# Altium project PicoBerry_V1.0.PrjPcb
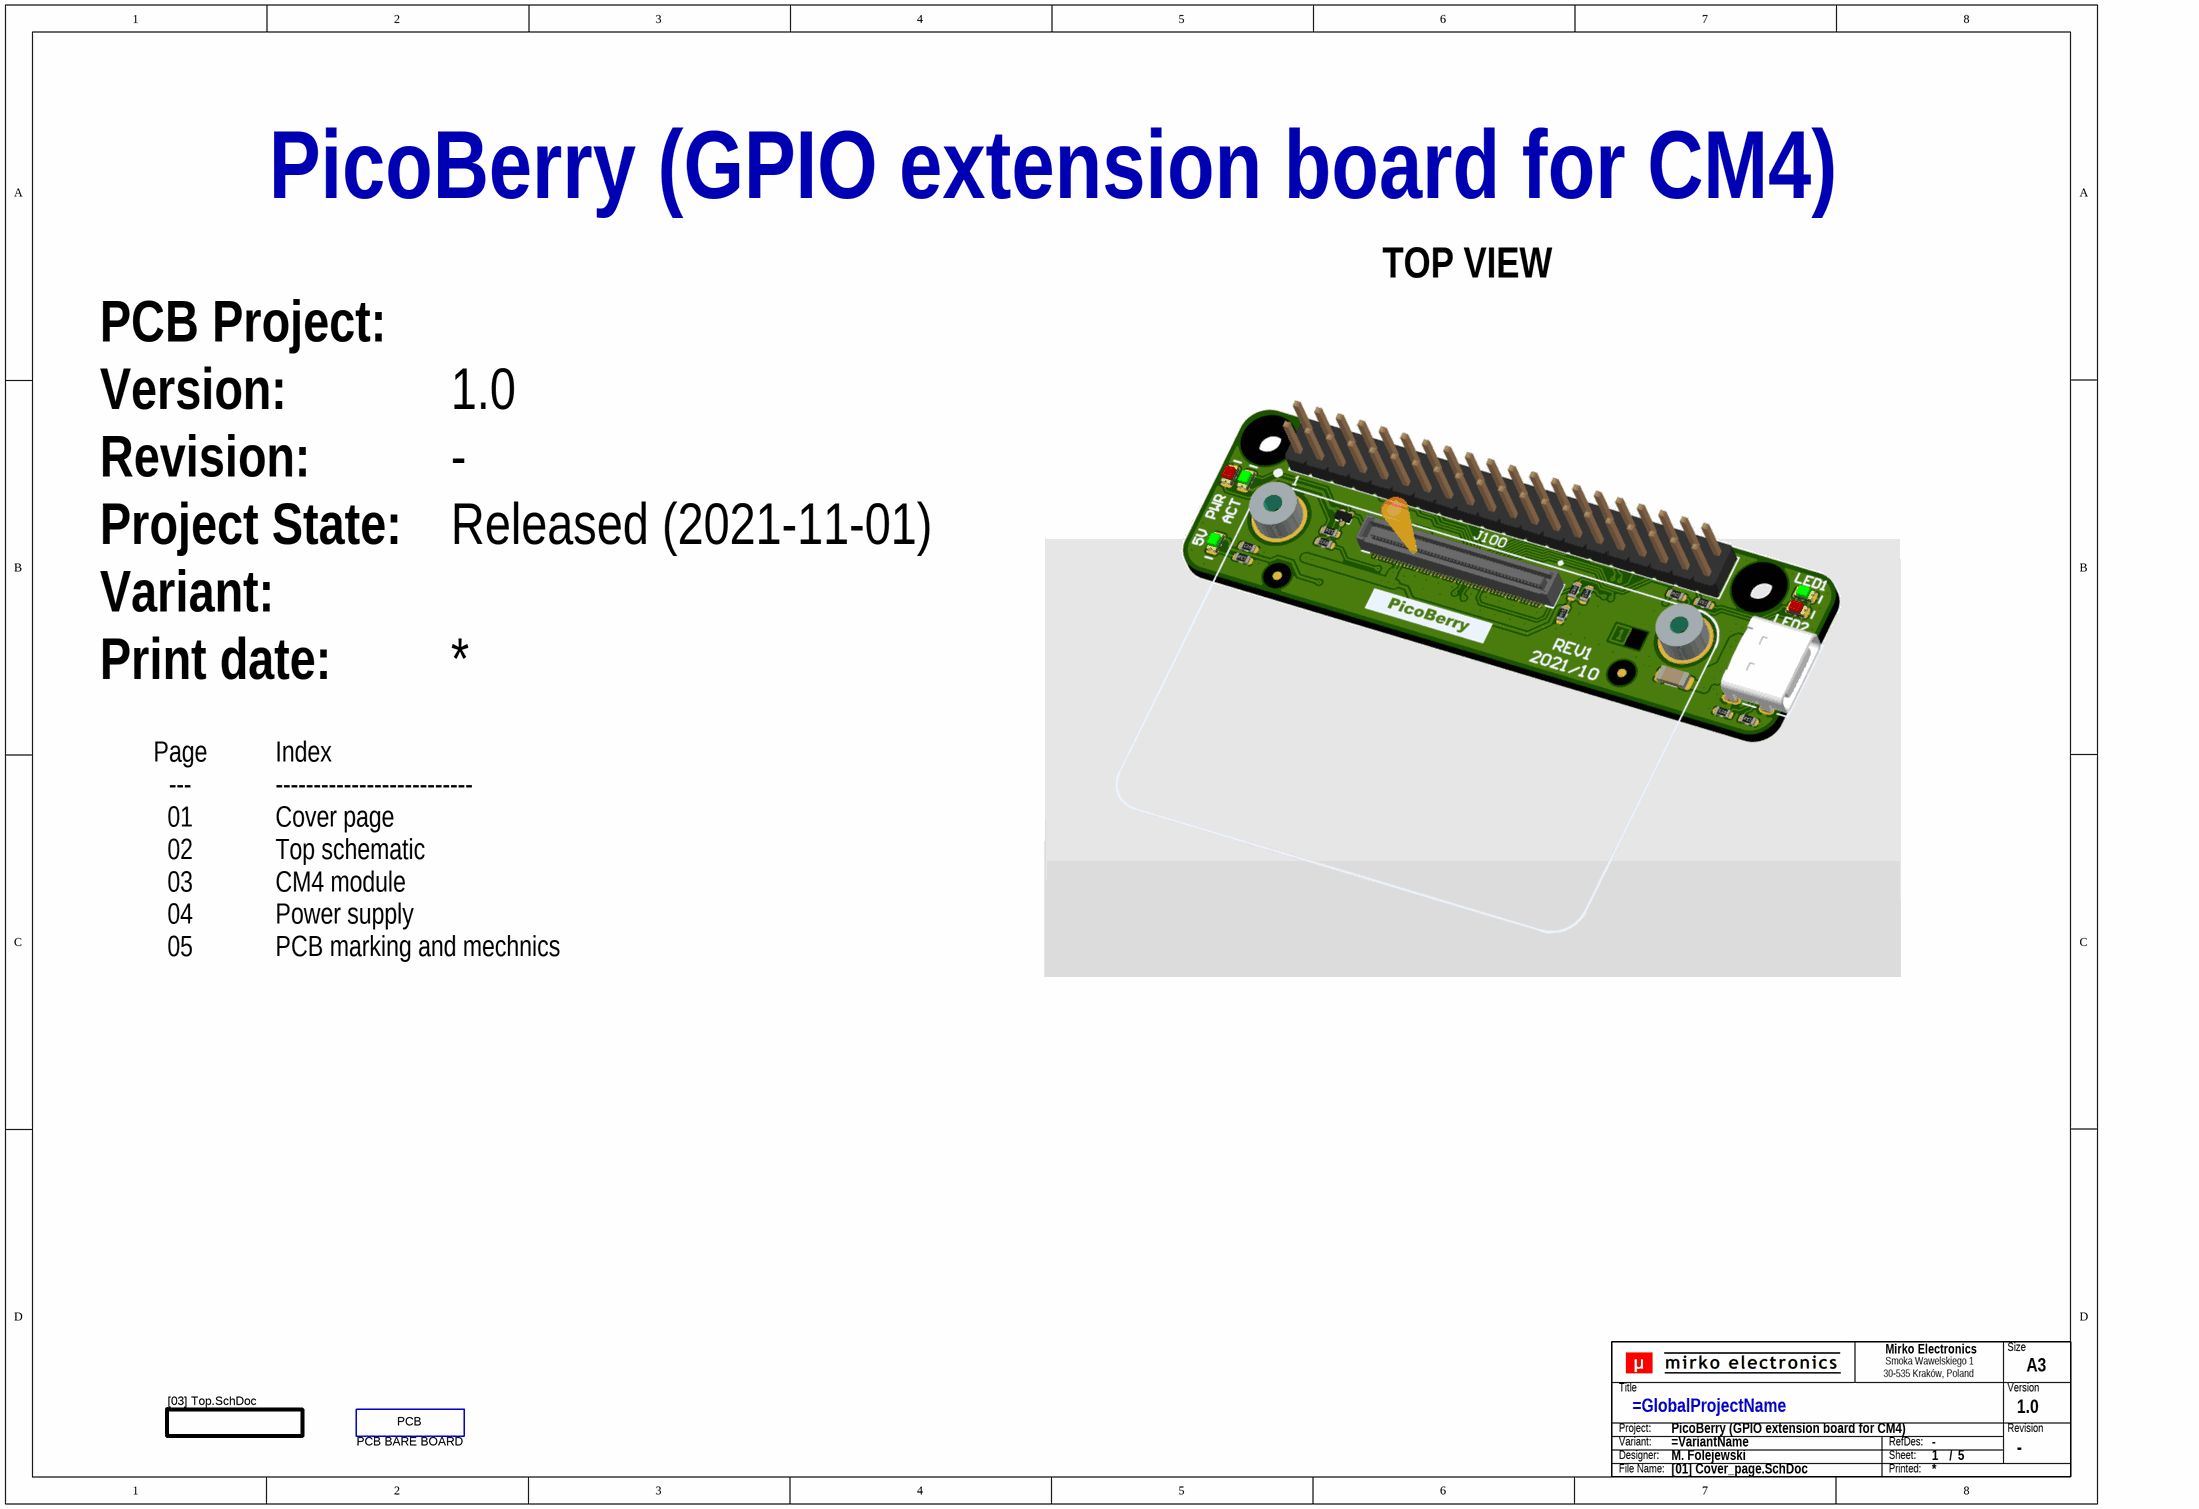
[diagram p0: [01] Cover_page.SchDoc]
GlobalProjectName: PicoBerry; OutputFileNamePrefix: PicoBerry_V1.0; PCBProjectName: PicoBerry (GPIO extension board for CM4); SchPcbReleaseState: Released (2021-11-01); SchPcbRevision: -; SchPcbVersion: 1.0
5 sheets, 41 parts. Net scope: global (net labels, ports and power ports of the same name join across sheets).
Board file: PicoBerry_V1.0.PcbDoc
Sheets:
  [01] Cover_page.SchDoc
  [02] TOP.SchDoc
  [03] CM4_PART1.SchDoc
  [04] PWR.SchDoc
  [05] PCB_Mech.SchDoc

## Sheet [01] Cover_page.SchDoc: =GlobalProjectName
size A3; Engineer: M. Folejewski; DocumentNumber: 1; SheetNumber: 1; SheetTotal: 5; Designators: -; PageSize: A3

### Parts
(Parts that share a designator on the sheet are numbered #1, #2 ... from top to bottom, then left to right.)
PCB1  PCB BARE BOARD  (mechanical)
TB?#1  Title block  (value not drawn)  (graphical)

### Sub-sheets
D9 = [03] Top.SchDoc (file not in this document): no entries

### Notes on the sheet
- TOP VIEW
- PCB Project:
- Version:
- Revision:
- Project State:
- Variant:
- Print date:
- Page
  ---
  01
  02
  03
  04
  05
- Index
  --------------------------
  Cover page
  Top schematic
  CM4 module
  Power supply
  PCB marking and mechnics
- (in symbol PCB_BARE_BOARD) PCB
- (in symbol SCH_TITLE_BLOCK_V1) Mirko Electronics; Size; Smoka Wawelskiego 1; 30-535 Kraków, Poland; Title; Version; Project:; Revision; Variant:; RefDes:; Designer:; Sheet:; /; File Name:; Printed:

### Library data of the parts
PCB1 = PCB_BARE_BOARD: Component Subtype: PCB Board; Component Type: PCB board; Manufacturer: -; MPN: N/A; Value: PCB BARE BOARD; Mounting Type: -; Supplier: ?
TB?#1 = SCH_TITLE_BLOCK_V1: Component Type: Title block; Manufacturer: -; Mounting Type: Non component; MPN: -; Operating Temperature: -; Package: -; Specification: Title block; Value: Title block; Replacement: -; System: ?

## Sheet [02] TOP.SchDoc: Top schematic
size A4; Engineer: M. Folejewski; DocumentNumber: 2; SheetNumber: 2; SheetTotal: 5; PageSize: A4; Designators: 1-99
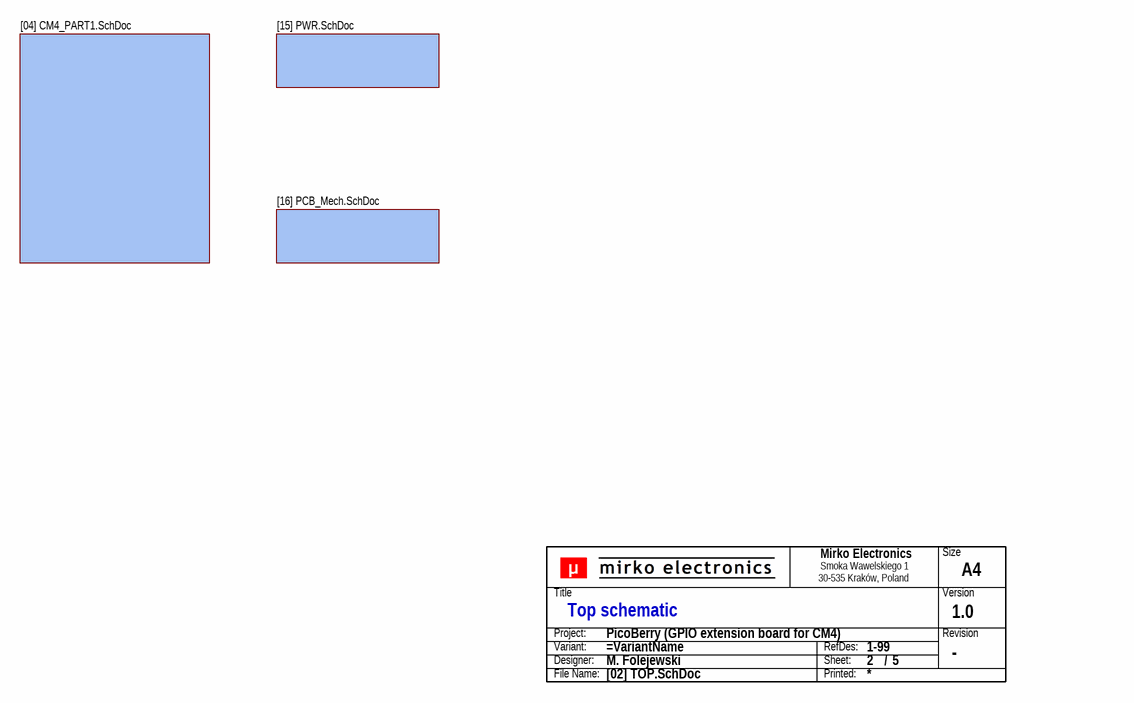
[diagram p1: [02] TOP.SchDoc]

### Parts
(Parts that share a designator on the sheet are numbered #1, #2 ... from top to bottom, then left to right.)
TB?#2  Title block  (value not drawn)  (graphical)

### Sub-sheets
BLK1 = [04] CM4_PART1.SchDoc (file not in this document): no entries
BLK4 = [16] PCB_Mech.SchDoc (file not in this document): no entries
BLK4 = [15] PWR.SchDoc (file not in this document): no entries

### Notes on the sheet
- (in symbol SCH_TITLE_BLOCK_V1) Mirko Electronics; Size; Smoka Wawelskiego 1; 30-535 Kraków, Poland; Title; Version; Project:; Revision; Variant:; RefDes:; Designer:; Sheet:; /; File Name:; Printed:

### Library data of the parts
TB?#2 = SCH_TITLE_BLOCK_V1: Component Type: Title block; Manufacturer: -; Mounting Type: Non component; MPN: -; Operating Temperature: -; Package: -; Specification: Title block; Value: Title block; Replacement: -; System: ?

## Sheet [03] CM4_PART1.SchDoc: Compute Module 4 (CM4)
size A3; Engineer: M. Folejewski; DocumentNumber: 3; SheetNumber: 3; SheetTotal: 5; PageSize: A3; Designators: 100-199
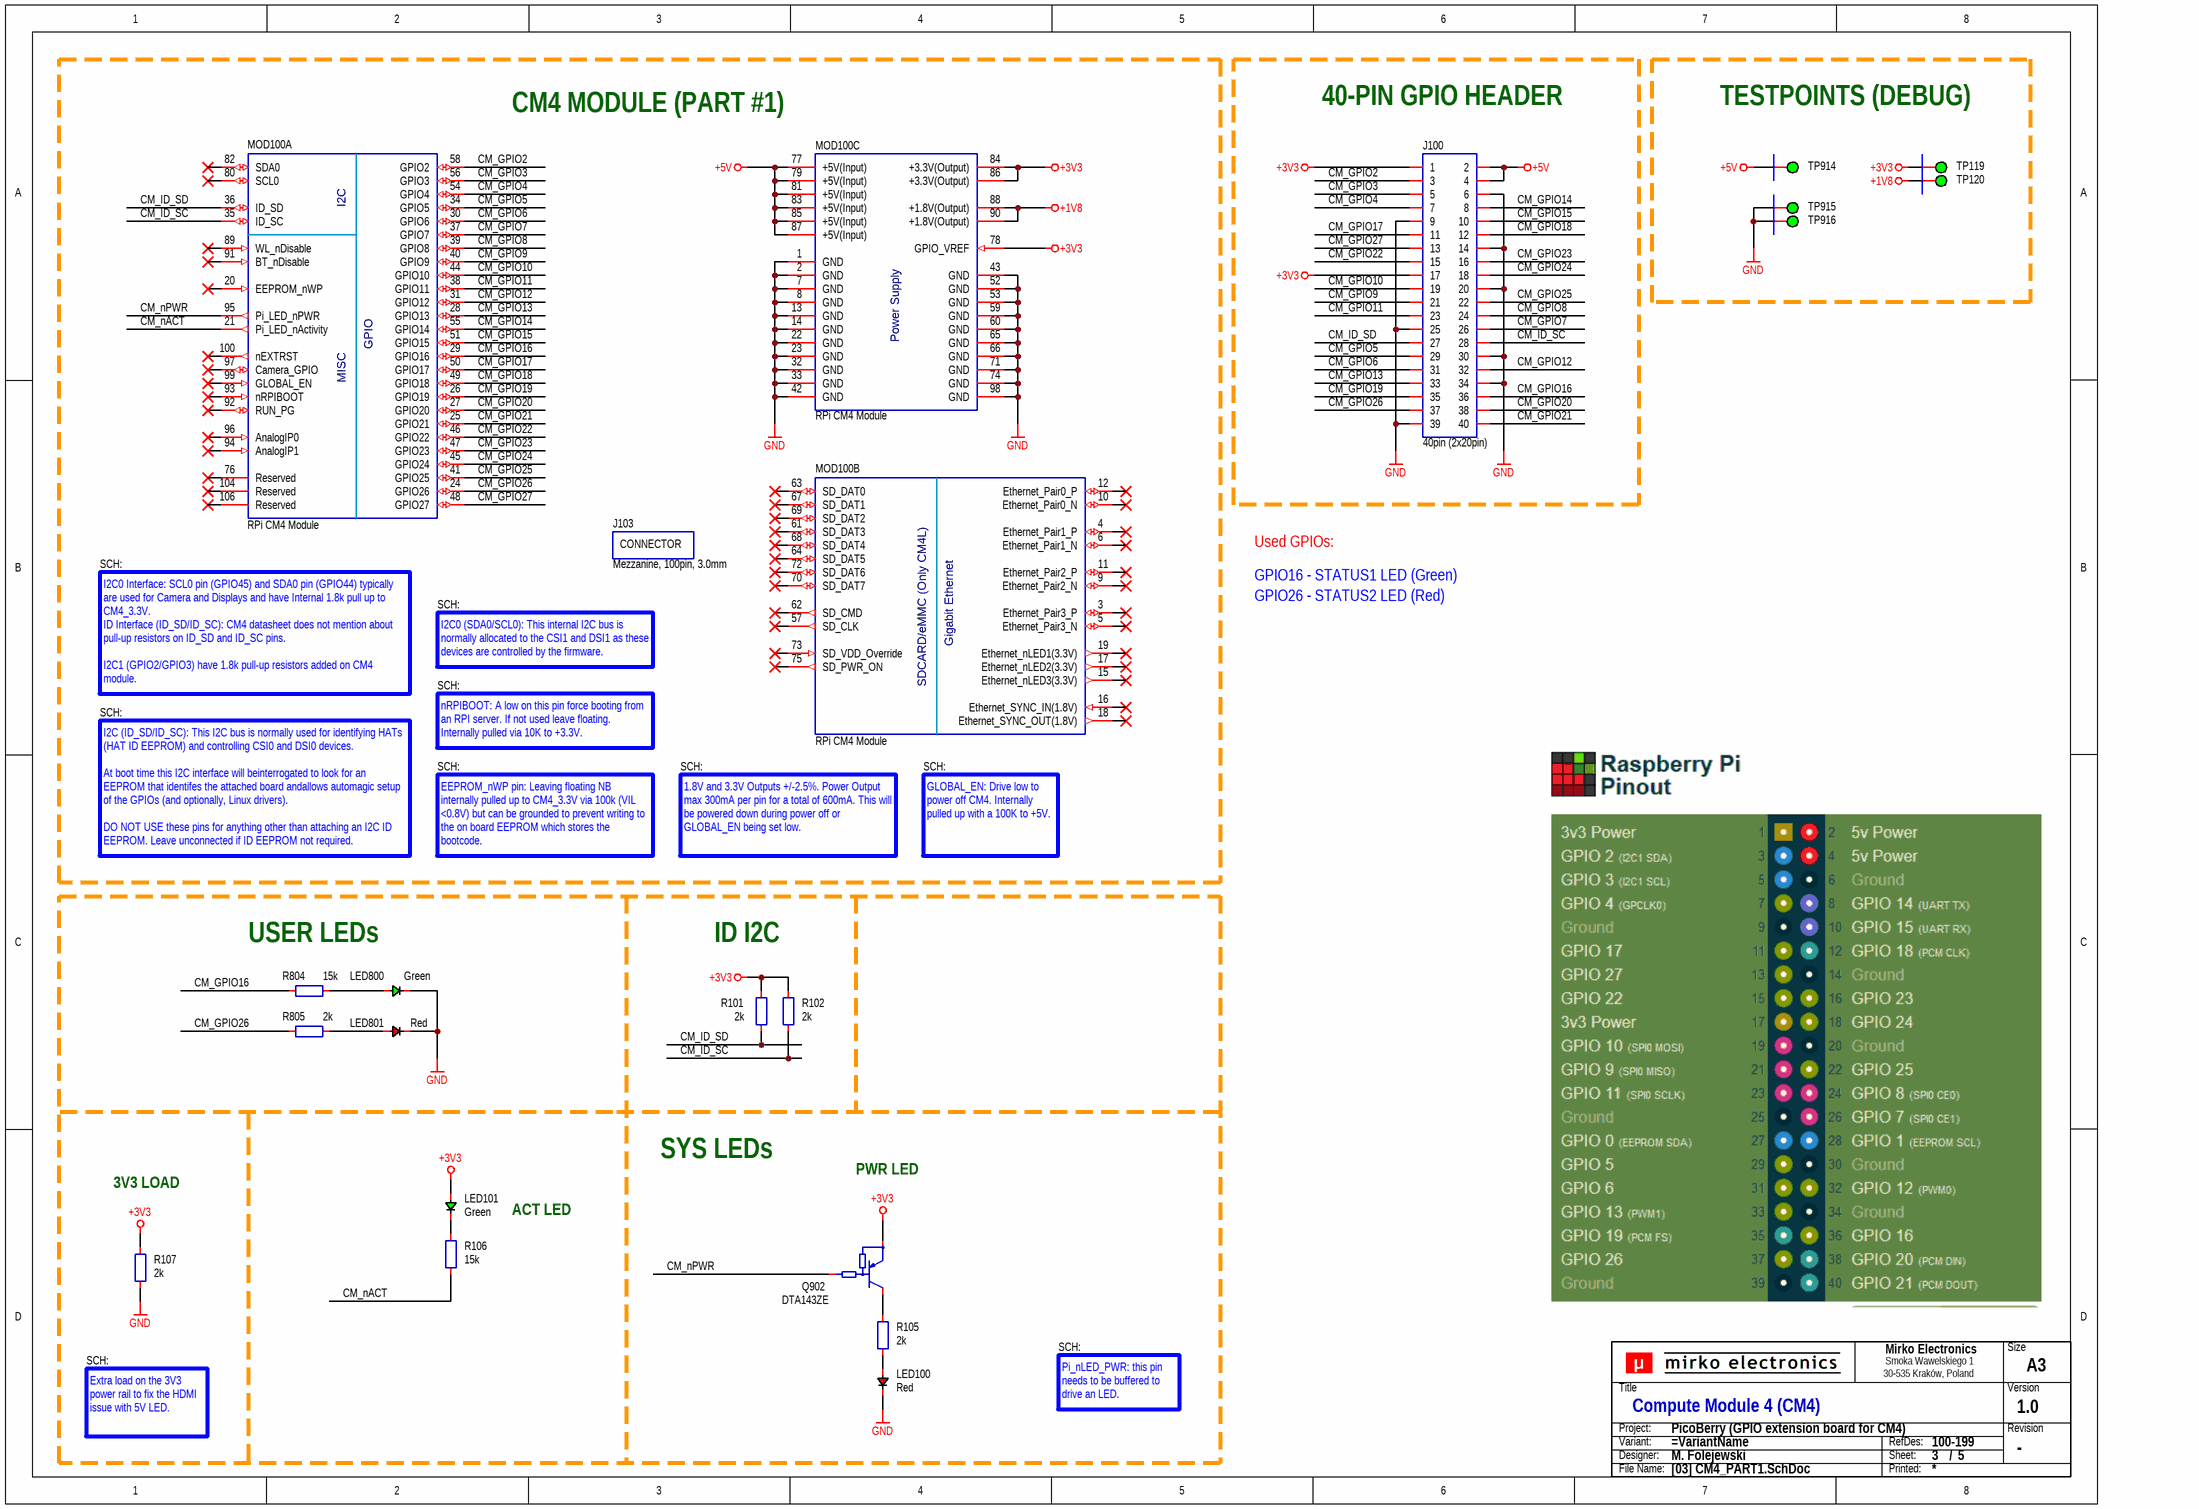
[diagram p2: [03] CM4_PART1.SchDoc]

### Parts
(Parts that share a designator on the sheet are numbered #1, #2 ... from top to bottom, then left to right.)
J100  40pin (2x20pin)  [CON_HDR_P254_2X20M_STR]
J103  Mezzanine, 100pin, 3.0mm  [PCB_BLANK_COMP_SMD]
LED100  Red  [LED_0805_RED_R]
LED101  Green  [LED_0805_GRN_R]
LED800  Green  [LED_0805_GRN_R]
LED801  Red  [LED_0805_RED_R]
MOD100  RPi CM4 Module  [MOD_RPI_CM4_P40_C300_CON1]  (parts A,B,C of 3)
Q902  DTA143ZE  [PKG_SOT523_SC75_SOT416_P100_R]
R101  2k  [RES_0603_R]
R102  2k  [RES_0603_R]
R105  2k  [RES_0603_R]
R106  15k  [RES_0603_R]
R107  2k  [RES_0603_R]
R804  15k  [RES_0603_R]
R805  2k  [RES_0603_R]
TB?#3  Title block  (value not drawn)  (graphical)
TP119  ICT  [PCB_TP_ICT_100]  (value not drawn)  (no BOM)
TP120  ICT  [PCB_TP_ICT_100]  (value not drawn)  (no BOM)
TP914  ICT  [PCB_TP_ICT_100]  (value not drawn)  (no BOM)
TP915  ICT  [PCB_TP_ICT_100]  (value not drawn)  (no BOM)
TP916  ICT  [PCB_TP_ICT_100]  (value not drawn)  (no BOM)

### Nets
+1V8: MOD100.88(+1.8V(Output)) MOD100.90(+1.8V(Output)) TP120.1
+3V3: J100.1 J100.17 LED101.2 MOD100.78(GPIO_VREF) MOD100.84(+3.3V(Output)) MOD100.86(+3.3V(Output)) Q902.2(E) R101.2 R102.2 R107.2 TP119.1
+5V: J100.2 J100.4 MOD100.77(+5V(Input)) MOD100.79(+5V(Input)) MOD100.81(+5V(Input)) MOD100.83(+5V(Input)) MOD100.85(+5V(Input)) MOD100.87(+5V(Input)) TP914.1
GND: J100.6 J100.9 J100.14 J100.20 J100.25 J100.30 J100.34 J100.39 LED100.1 LED800.1 LED801.1 MOD100.1(GND) MOD100.2(GND) MOD100.7(GND) MOD100.8(GND) MOD100.13(GND) MOD100.14(GND) MOD100.22(GND) MOD100.23(GND) MOD100.32(GND) MOD100.33(GND) MOD100.42(GND) MOD100.43(GND) MOD100.52(GND) MOD100.53(GND) MOD100.59(GND) MOD100.60(GND) MOD100.65(GND) MOD100.66(GND) MOD100.71(GND) MOD100.74(GND) MOD100.98(GND) R107.1 TP915.1 TP916.1
CM_GPIO2: J100.3 MOD100.58(GPIO2)
CM_GPIO3: J100.5 MOD100.56(GPIO3)
CM_GPIO4: J100.7 MOD100.54(GPIO4)
CM_GPIO5: J100.29 MOD100.34(GPIO5)
CM_GPIO6: J100.31 MOD100.30(GPIO6)
CM_GPIO7: J100.26 MOD100.37(GPIO7)
CM_GPIO8: J100.24 MOD100.39(GPIO8)
CM_GPIO9: J100.21 MOD100.40(GPIO9)
CM_GPIO10: J100.19 MOD100.44(GPIO10)
CM_GPIO11: J100.23 MOD100.38(GPIO11)
CM_GPIO12: J100.32 MOD100.31(GPIO12)
CM_GPIO13: J100.33 MOD100.28(GPIO13)
CM_GPIO14: J100.8 MOD100.55(GPIO14)
CM_GPIO15: J100.10 MOD100.51(GPIO15)
CM_GPIO16: J100.36 MOD100.29(GPIO16) R804.1
CM_GPIO17: J100.11 MOD100.50(GPIO17)
CM_GPIO18: J100.12 MOD100.49(GPIO18)
CM_GPIO19: J100.35 MOD100.26(GPIO19)
CM_GPIO20: J100.38 MOD100.27(GPIO20)
CM_GPIO21: J100.40 MOD100.25(GPIO21)
CM_GPIO22: J100.15 MOD100.46(GPIO22)
CM_GPIO23: J100.16 MOD100.47(GPIO23)
CM_GPIO24: J100.18 MOD100.45(GPIO24)
CM_GPIO25: J100.22 MOD100.41(GPIO25)
CM_GPIO26: J100.37 MOD100.24(GPIO26) R805.1
CM_GPIO27: J100.13 MOD100.48(GPIO27)
CM_ID_SC: J100.28 MOD100.35(ID_SC) R102.1
CM_ID_SD: J100.27 MOD100.36(ID_SD) R101.1
CM_nACT: MOD100.21(Pi_LED_nActivity) R106.1
CM_nPWR: MOD100.95(Pi_LED_nPWR) Q902.1(B)
NetLED100_2: LED100.2 R105.1
NetLED101_1: LED101.1 R106.2
NetLED800_2: LED800.2 R804.2
NetLED801_2: LED801.2 R805.2
NetQ902_3: Q902.3(C) R105.2

Not connected (* = marked no-connect by the designer): MOD100 3(Ethernet_Pair3_P)* 4(Ethernet_Pair1_P)* 5(Ethernet_Pair3_N)* 6(Ethernet_Pair1_N)* 9(Ethernet_Pair2_N)* 10(Ethernet_Pair0_N)* 11(Ethernet_Pair2_P)* 12(Ethernet_Pair0_P)* 15(Ethernet_nLED3(3.3V))* 16(Ethernet_SYNC_IN(1.8V))* 17(Ethernet_nLED2(3.3V))* 18(Ethernet_SYNC_OUT(1.8V))* 19(Ethernet_nLED1(3.3V))* 20(EEPROM_nWP)* 57(SD_CLK)* 61(SD_DAT3)* 62(SD_CMD)* 63(SD_DAT0)* 64(SD_DAT5)* 67(SD_DAT1)* 68(SD_DAT4)* 69(SD_DAT2)* 70(SD_DAT7)* 72(SD_DAT6)* 73(SD_VDD_Override)* 75(SD_PWR_ON)* 76(Reserved)* 80(SCL0)* 82(SDA0)* 89(WL_nDisable)* 91(BT_nDisable)* 92(RUN_PG)* 93(nRPIBOOT)* 94(AnalogIP1)* 96(AnalogIP0)* 97(Camera_GPIO)* 99(GLOBAL_EN)* 100(nEXTRST)* 104(Reserved)* 106(Reserved)*

### Notes on the sheet
- 40-PIN GPIO HEADER
- TESTPOINTS (DEBUG)
- (near MOD100) CM4 MODULE (PART #1)
- SCH:
- Used GPIOs:
- GPIO16 - STATUS1 LED (Green)
- GPIO26 - STATUS2 LED (Red)
- I2C0 Interface: SCL0 pin (GPIO45) and SDA0 pin (GPIO44) typically are used for Camera and Displays and have Internal 1.8k pull up to CM4_3.3V.
  ID Interface (ID_SD/ID_SC): CM4 datasheet does not mention about pull-up resistors on ID_SD and ID_SC pins.
  I2C1 (GPIO2/GPIO3) have 1.8k pull-up resistors added on CM4 module.
- I2C0 (SDA0/SCL0): This internal I2C bus is normally allocated to the CSI1 and DSI1 as these devices are controlled by the firmware.
- nRPIBOOT: A low on this pin force booting from an RPI server. If not used leave floating. Internally pulled via 10K to +3.3V.
- (near MOD100) SCH:
- I2C (ID_SD/ID_SC): This I2C bus is normally used for identifying HATs (HAT ID EEPROM) and controlling CSI0 and DSI0 devices.
  At boot time this I2C interface will beinterrogated to look for an EEPROM that identifes the attached board andallows automagic setup of the GPIOs (and optionally, Linux drivers).
  DO NOT USE these pins for anything other than attaching an I2C ID EEPROM. Leave unconnected if ID EEPROM not required.
- EEPROM_nWP pin: Leaving floating NB internally pulled up to CM4_3.3V via 100k (VIL <0.8V) but can be grounded to prevent writing to the on board EEPROM which stores the bootcode.
- 1.8V and 3.3V Outputs +/-2.5%. Power Output max 300mA per pin for a total of 600mA. This will be powered down during power off or GLOBAL_EN being set low.
- GLOBAL_EN: Drive low to power off CM4. Internally pulled up with a 100K to +5V.
- USER LEDs
- ID I2C
- 3V3 LOAD
- SYS LEDs
- PWR LED
- ACT LED
- Extra load on the 3V3 power rail to fix the HDMI issue with 5V LED.
- Pi_nLED_PWR: this pin needs to be buffered to drive an LED.
- (in symbol BOM_CON) CONNECTOR
- (in symbol MOD_RPI_CM4_VAR3_CON1, part A) I2C; GPIO; MISC
- (in symbol MOD_RPI_CM4_VAR3_CON1, part B) Gigabit Ethernet; SDCARD/eMMC (Only CM4L)
- (in symbol MOD_RPI_CM4_VAR3_CON1, part C) Power Supply
- (in symbol SCH_TITLE_BLOCK_V1) Mirko Electronics; Size; Smoka Wawelskiego 1; 30-535 Kraków, Poland; Title; Version; Project:; Revision; Variant:; RefDes:; Designer:; Sheet:; /; File Name:; Printed:

### Library data of the parts
J100 = CON_2X20_ROW: Connector; 2 Row;; Manufacturer: GENERIC; Component Subtype: Pin Header; MPN: GENERIC; Value: 40pin (2x20pin); Component Type: Connector; Mounting Type: THT; Supplier: ?
J103 = BOM_CON: BOM list; Connector;; Manufacturer: Hirose; MPN: DF40HC(3.0)-100DS-0.4V; Component Subtype: Microminiature; Package (Case): SMD; Value: Mezzanine, 100pin, 3.0mm; Component Type: Connector; Mounting Type: SMD; Supplier: ?
LED100 LED801 = DIO_LED_RED: Diode; LED; Red;; Manufacturer: Foshan NationStar Optoelectronics; MPN: NCD0805R1; Component Subtype: LED Diode; Package (Case): 0805 (2012); Value: Red; Component Type: LED; Mounting Type: SMD; Supplier: LCSC
LED101 LED800 = DIO_LED_GRN: Diode; LED; Green;; Manufacturer: Foshan NationStar Optoelectronics; MPN: NCD0805G1; Component Subtype: LED Diode; Package (Case): 0805 (2012); Value: Green; Component Type: LED; Mounting Type: SMD; Supplier: LCSC
MOD100 = MOD_RPI_CM4_VAR3_CON1: PCB Module; RPi Compute Module 4; Connector #1 (pins 1-100); Manufacturer: Raspberry Pi Foundation; Component Subtype: Raspberry Pi CM4; Component Type: PCB Module; Mounting Type: -; MPN: CM4 Module; Supplier: ?; Value: RPi CM4 Module
Q902 = TRA_BJT_PNP_DIG_ONS_DTA143ZE: Transistor; BJT; PNP; Digital (Biased);; Manufacturer: On Semiconductor; MPN: DTA143ZET1G; Component Type: Transistor; Mounting Type: SMD; Value: DTA143ZE
R101 R102 R105 R107 R805 = RES-0033: Resistor; Thick Film; 2k2; 1%; 100mW; 100PPM; 75V; Standard; SMD; 0603 (1608);; Manufacturer: Yageo Corporation; MPN: TBD; Component Type: Resistor; Component Subtype: Thick Film; Value: 2k; Mounting Type: SMD; Package (Case): 0603 (1608); Supplier: ?
R106 R804 = RES-0043: Resistor; Thick Film; 15k; 1%; 100mW; 100PPM; 75V; Standard; SMD; 0603 (1608);; Manufacturer: Yageo Corporation; MPN: TBD; Component Type: Resistor; Component Subtype: Thick Film; Value: 15k; Mounting Type: SMD; Package (Case): 0603 (1608); Supplier: ?
TB?#3 = SCH_TITLE_BLOCK_V1: Component Type: Title block; Manufacturer: -; Mounting Type: Non component; MPN: -; Operating Temperature: -; Package: -; Specification: Title block; Value: Title block; Replacement: -; System: ?
TP119 TP120 TP914-TP916 = PCB_TP_ICT: Test Point (ICT); Specification: Testpoint (for ICT), SMD pad; Component Type: Testpoint (for ICT); Manufacturer: -; Mounting Type: Non component; MPN: -; Value: ICT

## Sheet [04] PWR.SchDoc: +5V power supply
size A4; Engineer: M. Folejewski; DocumentNumber: 4; SheetNumber: 4; SheetTotal: 5; PageSize: A4; Designators: 900-949
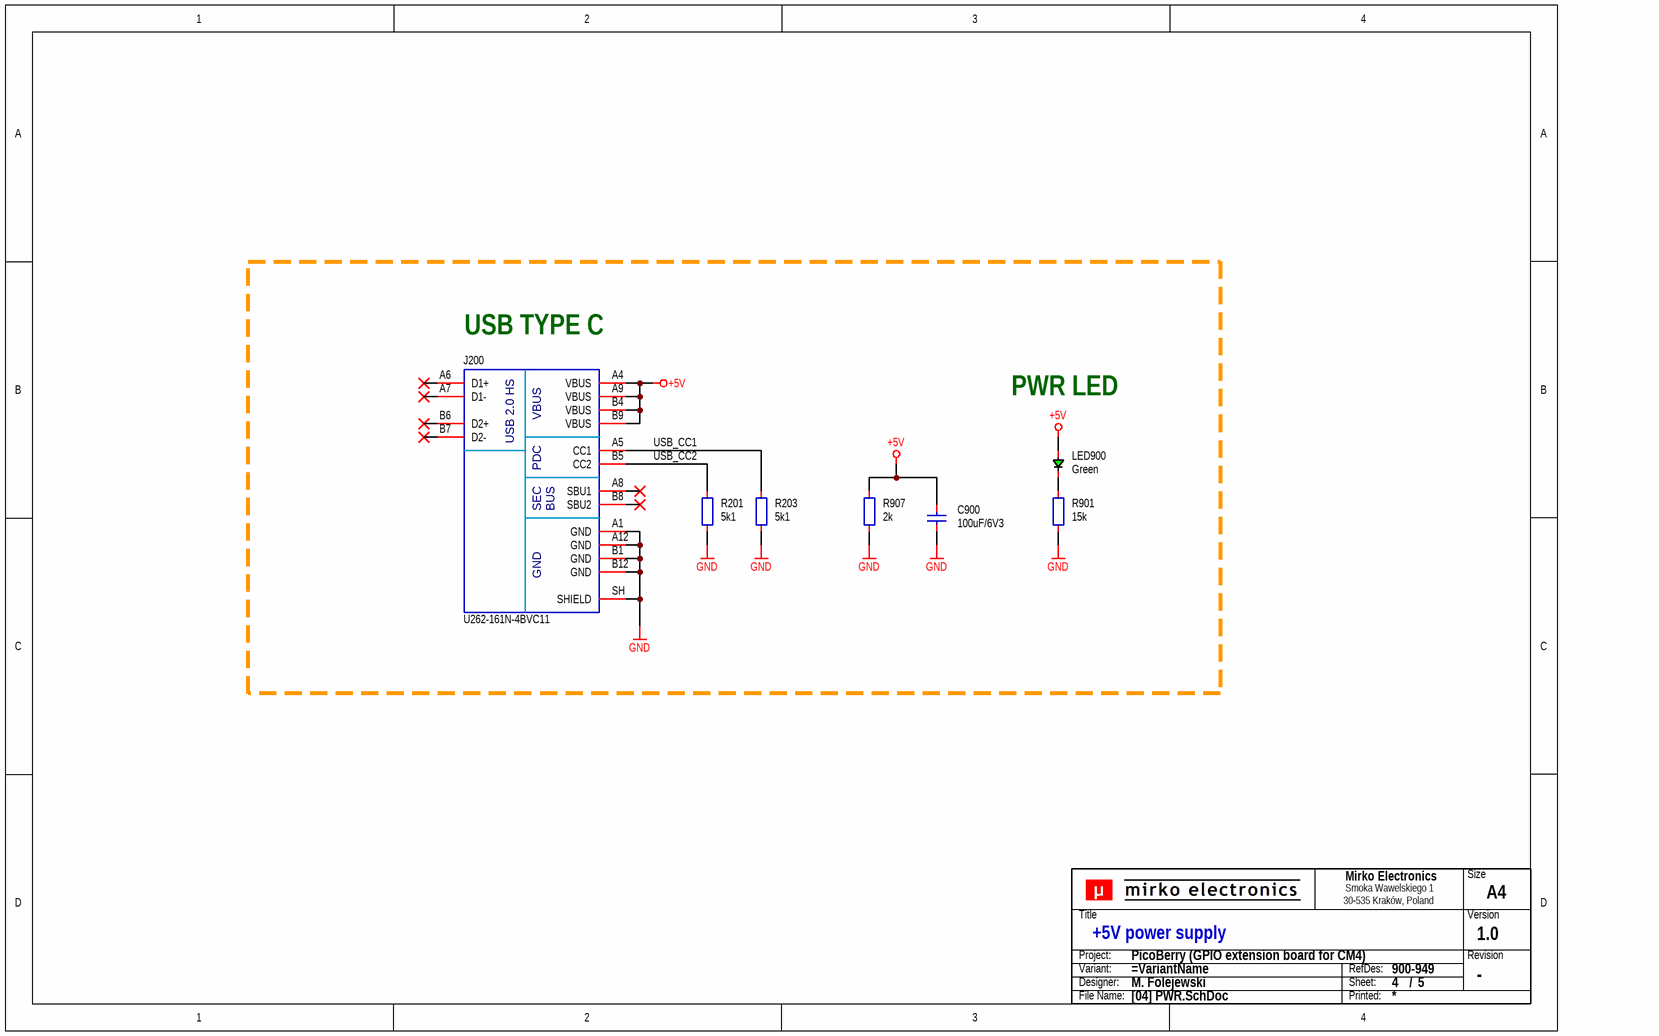
[diagram p3: [04] PWR.SchDoc]

### Parts
(Parts that share a designator on the sheet are numbered #1, #2 ... from top to bottom, then left to right.)
C900  100uF/6V3  [CAP_1206_R]
J200  U262-161N-4BVC11  [CON_XKB_U262-161N-4BVC11]
LED900  Green  [LED_0805_GRN_R]
R201  5k1  [RES_0603_R]
R203  5k1  [RES_0603_R]
R901  15k  [RES_0603_R]
R907  2k  [RES_0603_R]
TB?#4  Title block  (value not drawn)  (graphical)

### Nets
+5V: C900.2 J200.A4(VBUS) J200.A9(VBUS) J200.B4(VBUS) J200.B9(VBUS) LED900.2 R907.2
GND: C900.1 J200.A1(GND) J200.A12(GND) J200.B1(GND) J200.B12(GND) J200.SH(SHIELD) R201.2 R203.2 R901.2 R907.1
USB_CC1: J200.A5(CC1) R203.1
USB_CC2: J200.B5(CC2) R201.1
NetLED900_1: LED900.1 R901.1

Not connected (* = marked no-connect by the designer): J200 A6(D1+)* A7(D1-)* A8(SBU1)* B6(D2+)* B7(D2-)* B8(SBU2)*

### Notes on the sheet
- (near J200) USB TYPE C
- PWR LED
- (in symbol CON_USB_TYPE_C_16P) USB 2.0 HS; PDC; SEC; BUS
- (in symbol SCH_TITLE_BLOCK_V1) Mirko Electronics; Size; Smoka Wawelskiego 1; 30-535 Kraków, Poland; Title; Version; Project:; Revision; Variant:; RefDes:; Designer:; Sheet:; /; File Name:; Printed:

### Library data of the parts
C900 = CAP-0025: Capacitor; MLCC; GENERIC; TBD; TBD; TBD; TBD; SMD; 1206 (3216);; Component Type: Capacitor; Component Subtype: MLCC; Value: 100uF/6V3; Manufacturer: GENERIC; MPN: GENERIC; Mounting Type: SMD; Package (Case): 1206 (3216); Supplier: ?
J200 = CON_USB_TYPE_C_16P: Connector; USB 3.1 Type C; Receptacle; 24-pin; USB 2.0 Only;; Manufacturer: XKB Connectivity; Component Subtype: USB-C; Package (Case): SMD; Value: U262-161N-4BVC11; MPN: U262-161N-4BVC11; Component Type: Connector; Mounting Type: SMD; Supplier: ?
LED900 = DIO_LED_GRN: as LED101 on sheet [03] CM4_PART1; Value: Green; Component Type: LED; Mounting Type: SMD; Supplier: LCSC
R201 R203 = RES-0043: Resistor; Thick Film; 5k1; 1%; 100mW; 100PPM; 75V; Standard; SMD; 0603 (1608);; Manufacturer: Yageo Corporation; MPN: TBD; Component Type: Resistor; Component Subtype: Thick Film; Value: 5k1; Mounting Type: SMD; Package (Case): 0603 (1608); Supplier: ?
R901 = RES-0043: as R106 on sheet [03] CM4_PART1; Component Type: Resistor; Component Subtype: Thick Film; Value: 15k; Mounting Type: SMD; Package (Case): 0603 (1608); Supplier: ?
R907 = RES-0033: as R101 on sheet [03] CM4_PART1; Component Type: Resistor; Component Subtype: Thick Film; Value: 2k; Mounting Type: SMD; Package (Case): 0603 (1608); Supplier: ?
TB?#4 = SCH_TITLE_BLOCK_V1: Component Type: Title block; Manufacturer: -; Mounting Type: Non component; MPN: -; Operating Temperature: -; Package: -; Specification: Title block; Value: Title block; Replacement: -; System: ?

## Sheet [05] PCB_Mech.SchDoc: PCB marking & mechanical parts
size A4; Engineer: M. Folejewski; DocumentNumber: 5; SheetNumber: 5; SheetTotal: 5; PageSize: A4; Designators: 950-999
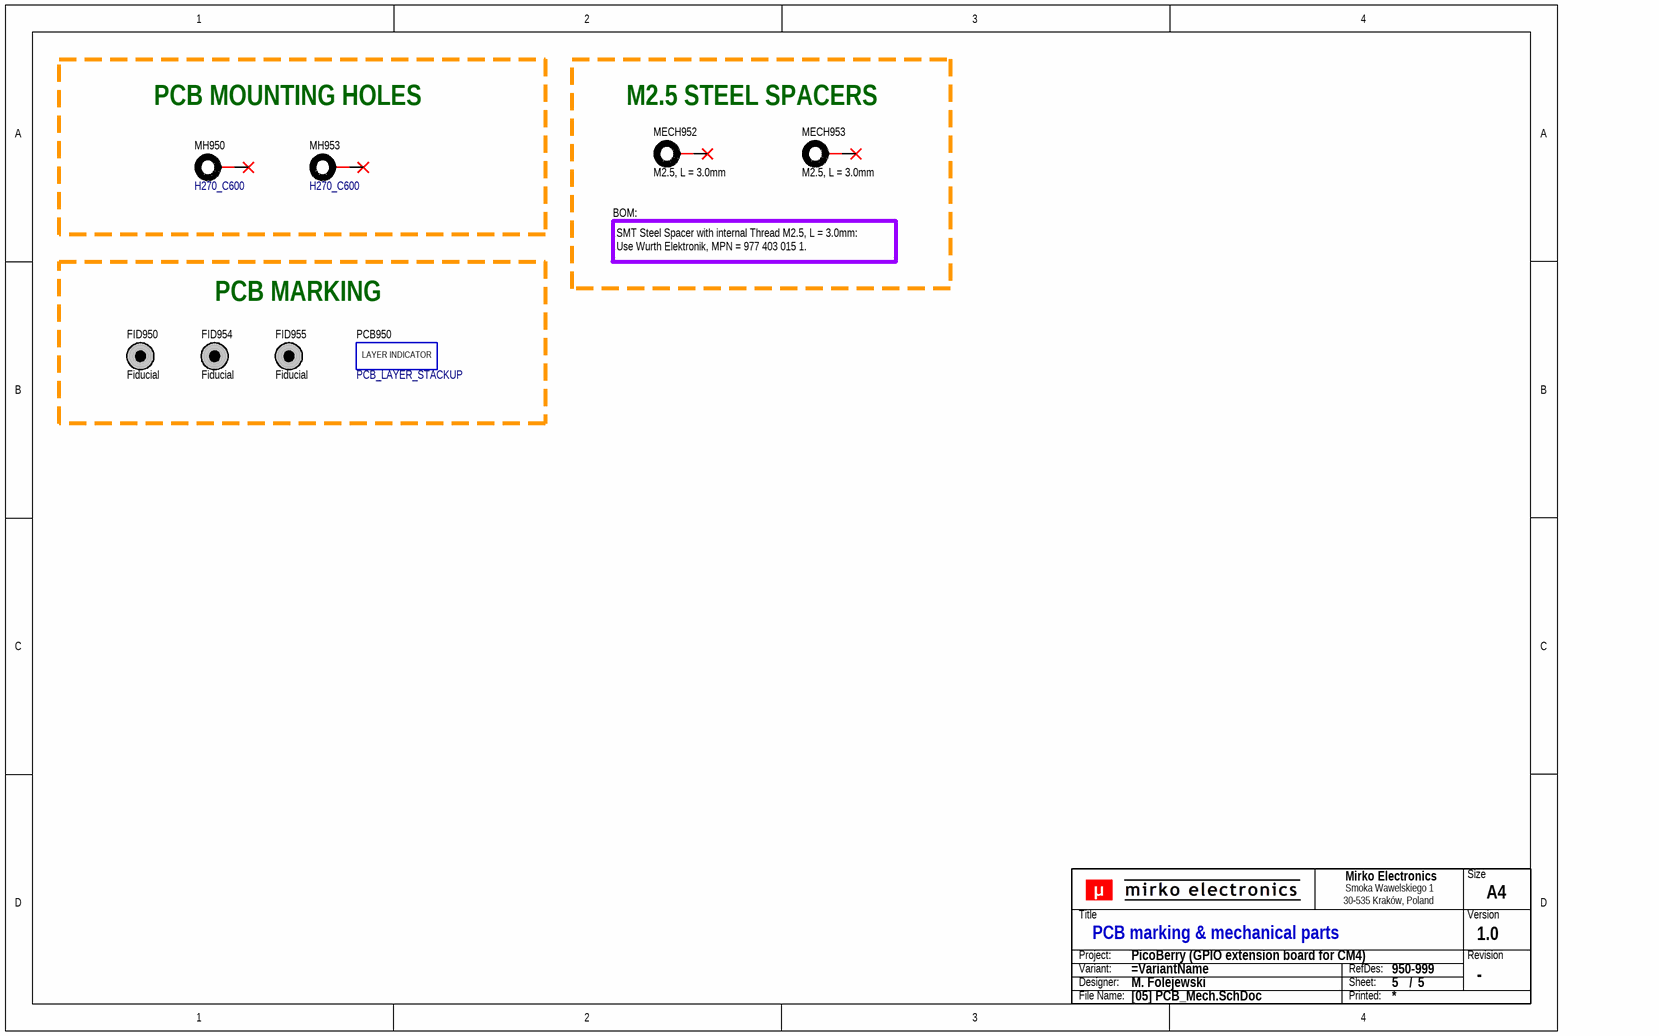
[diagram p4: [05] PCB_Mech.SchDoc]

### Parts
(Parts that share a designator on the sheet are numbered #1, #2 ... from top to bottom, then left to right.)
FID950  Fiducial  [PCB_FID_RND_100x300]  (no BOM)
FID954  Fiducial  [PCB_FID_RND_100x300]  (no BOM)
FID955  Fiducial  [PCB_FID_RND_100x300]  (no BOM)
MECH952  M2.5, L = 3.0mm  [PCB_WRT_9774030151]
MECH953  M2.5, L = 3.0mm  [PCB_WRT_9774030151]
MH950  H270_C600  [PCB_MH_H270_C600]  (no BOM)
MH953  H270_C600  [PCB_MH_H270_C600]  (no BOM)
PCB950  PCB_LAYER_STACKUP  [PCB_STACKUP-2L_A1]  (no BOM)
TB?#5  Title block  (value not drawn)  (graphical)

### Nets

Not connected (* = marked no-connect by the designer): MECH952 1*; MECH953 1*; MH950 1*; MH953 1*

### Notes on the sheet
- PCB MOUNTING HOLES
- M2.5 STEEL SPACERS
- BOM:
- PCB MARKING
- SMT Steel Spacer with internal Thread M2.5, L = 3.0mm:
  Use Wurth Elektronik, MPN = 977 403 015 1.
- (in symbol PCB_LAYER_STACKUP) LAYER INDICATOR
- (in symbol SCH_TITLE_BLOCK_V1) Mirko Electronics; Size; Smoka Wawelskiego 1; 30-535 Kraków, Poland; Title; Version; Project:; Revision; Variant:; RefDes:; Designer:; Sheet:; /; File Name:; Printed:

### Library data of the parts
FID950 FID954 FID955 = PCB_FID_RND: PCB Marking; Fiducial; Round;; Value: Fiducial; Component Subtype: -; Component Type: Fiducial; Mounting Type: -; Supplier: ?
MECH952 MECH953 = PCB_MECH_WRT_WA-SMSI: PCB; Mechanical; SMT Steel Spacer; M2.5;; Manufacturer: Wurth Elektronik; MPN: 977 403 015 1; Component Subtype: SMD Spacer; Package (Case): SMD; Value: M2.5, L = 3.0mm; Component Type: Spacer (Standoff); Mounting Type: SMD; Supplier: Wurth Elektronik
MH950 MH953 = PCB_MECH_MH: PCB Marking; Mounting hole;; Component Subtype: -; Component Type: Mounting Hole; Mounting Type: -; Supplier: ?
TB?#5 = SCH_TITLE_BLOCK_V1: Component Type: Title block; Manufacturer: -; Mounting Type: Non component; MPN: -; Operating Temperature: -; Package: -; Specification: Title block; Value: Title block; Replacement: -; System: ?
PCB950 = PCB_LAYER_STACKUP: Component Subtype: -; Component Type: PCB Marking; Mounting Type: -; Supplier: ?

## Nets that join several sheets
+5V: [03] CM4_PART1 (9 pins), [04] PWR (7 pins)
GND: [03] CM4_PART1 (35 pins), [04] PWR (10 pins)

## Assembly variants
STD: not fitted C103 C266 C267 C270 J8 J101 J102 J202 MOD300 R3 R7 R44 R48 R49 R204 R257 R302 R303 R600 R603 R606 R608 R709 R710 R713 R714 R715 R800 R801 R802 R807 R809 U600